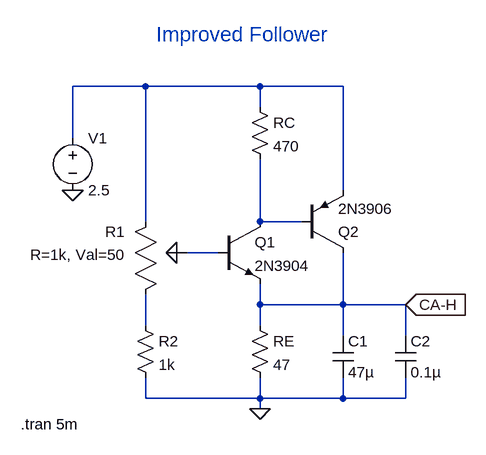
[diagram p0: schematic improved_follower_ltspice.asc]
improved_follower_ltspice.asc, the LTspice schematic file:
Version 4
SHEET 1 880 680
WIRE 0 144 -112 144
WIRE 176 144 0 144
WIRE 304 144 176 144
WIRE 176 176 176 144
WIRE -112 224 -112 144
WIRE 304 304 304 144
WIRE 0 352 0 144
WIRE 176 352 176 256
WIRE 240 352 176 352
WIRE 112 400 64 400
WIRE 176 480 176 448
WIRE 304 480 304 400
WIRE 304 480 176 480
WIRE 400 480 304 480
WIRE 0 512 0 464
WIRE 176 512 176 480
WIRE 304 528 304 480
WIRE 400 528 400 480
WIRE 0 624 0 592
WIRE 176 624 176 592
WIRE 176 624 0 624
WIRE 304 624 304 592
WIRE 304 624 176 624
WIRE 400 624 400 592
WIRE 400 624 304 624
WIRE 176 640 176 624
FLAG -112 304 0
FLAG 176 640 0
FLAG 400 480 CA-H
IOPIN 400 480 In
SYMBOL npn 112 352 R0
SYMATTR InstName Q1
SYMATTR Value 2N3904
SYMBOL pnp 240 400 M180
SYMATTR InstName Q2
SYMATTR Value 2N3906
SYMBOL res 160 160 R0
SYMATTR InstName RC
SYMATTR Value 470
SYMBOL res 160 496 R0
SYMATTR InstName RE
SYMATTR Value 47
SYMBOL res -16 496 R0
SYMATTR InstName R2
SYMATTR Value 1k
SYMBOL potentiometer 16 368 M0
WINDOW 0 47 0 Left 2
WINDOW 39 47 35 Left 2
SYMATTR InstName R1
SYMATTR SpiceLine R=1k, Val=50
SYMBOL cap 288 528 R0
SYMATTR InstName C1
SYMATTR Value 47µ
SYMBOL cap 384 528 R0
SYMATTR InstName C2
SYMATTR Value 0.1µ
SYMBOL voltage -112 208 R0
SYMATTR InstName V1
SYMATTR Value 2.5
TEXT 16 64 Left 3 ;Improved Follower
TEXT -192 664 Left 2 !.tran 5m

The netlist it stands for:
* improved_follower_ltspice.asc
Q1 N002 N003 CA-H 0 2N3904
Q2 CA-H N002 N001 0 2N3906
RC N001 N002 470
RE CA-H 0 47
R2 N004 0 1k
XR1 N001 N003 N004 potentiometer R=1k, Val=50  ; pins 1 2 3
C1 CA-H 0 47µ
C2 CA-H 0 0.1µ
V1 N001 0 2.5
.model NPN NPN
.model PNP PNP
.lib standard.bjt
* Improved Follower
.tran 5m
.backanno
.end